# Altium project Direct FM modulator test.PrjPcb
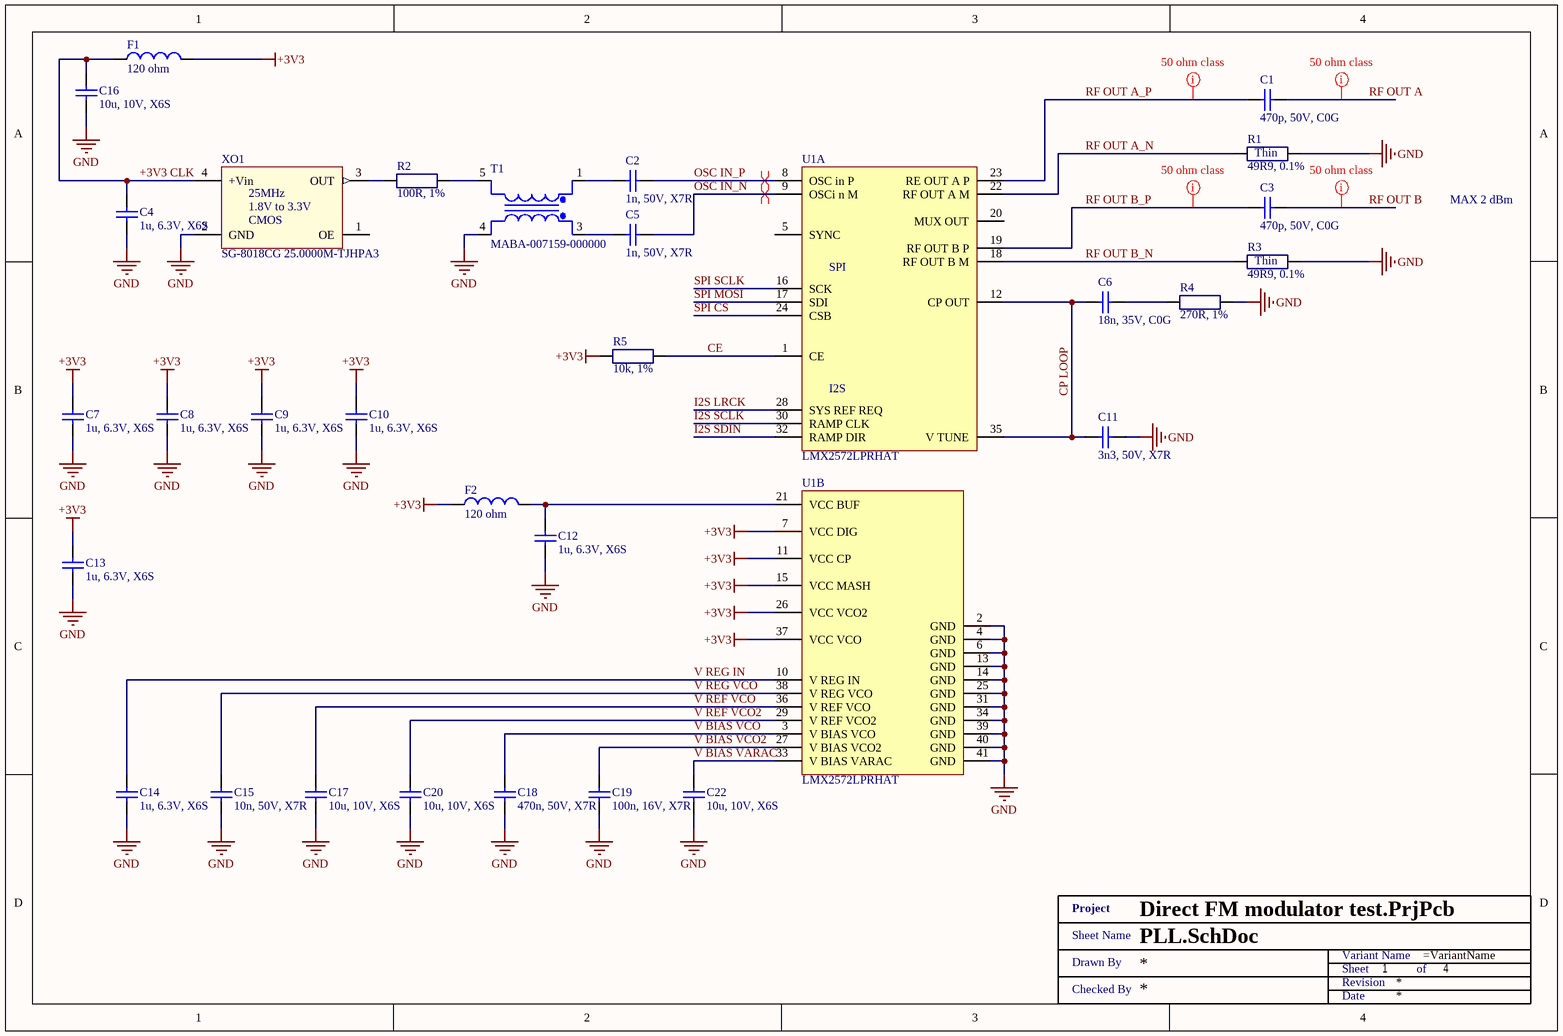
[diagram p0: PLL.SchDoc]
4 sheets, 49 parts. Net scope: global (net labels, ports and power ports of the same name join across sheets).
Board file: Direct FM modulator test.PcbDoc
Sheets:
  PLL.SchDoc
  Filter and output.SchDoc
  Connectors.SchDoc
  Poznamky.SchDoc

## Sheet PLL.SchDoc
size A4; DocumentNumber: 1; SheetNumber: 1; SheetTotal: 4

### Parts
(Parts that share a designator on the sheet are numbered #1, #2 ... from top to bottom, then left to right.)
C1  470p, 50V, C0G  [SMD0402]
C2  1n, 50V, X7R  [SMD0402]
C3  470p, 50V, C0G  [SMD0402]
C4  1u, 6.3V, X6S  [SMD0402]
C5  1n, 50V, X7R  [SMD0402]
C6  18n, 35V, C0G  [SMD0603]
C7  1u, 6.3V, X6S  [SMD0402]
C8  1u, 6.3V, X6S  [SMD0402]
C9  1u, 6.3V, X6S  [SMD0402]
C10  1u, 6.3V, X6S  [SMD0402]
C11  3n3, 50V, X7R  [SMD0603]
C12  1u, 6.3V, X6S  [SMD0402]
C13  1u, 6.3V, X6S  [SMD0402]
C14  1u, 6.3V, X6S  [SMD0402]
C15  10n, 50V, X7R  [SMD0402]
C16  10u, 10V, X6S  [SMD0603]
C17  10u, 10V, X6S  [SMD0603]
C18  470n, 50V, X7R  [SMD0603]
C19  100n, 16V, X7R  [SMD0402]
C20  10u, 10V, X6S  [SMD0603]
C22  10u, 10V, X6S  [SMD0603]
F1  120 ohm  [SMD0805 - R]
F2  120 ohm  [SMD0805 - R]
R1  49R9, 0.1%  [SMD0402 - R]
R2  100R, 1%  [SMD0402 - R]
R3  49R9, 0.1%  [SMD0402 - R]
R4  270R, 1%  [SMD0603 - R]
R5  10k, 1%  [SMD0603 - R]
T1  MABA-007159-000000  [MABA-007159-000000]
U1  LMX2572LPRHAT  [VQFN50P600X600X100_HS-41N]  (parts A,B of 2)
XO1  SG-8018CG 25.0000M-TJHPA3  [XO 2.5x2.0mm]
XX?#1  Title 1  (value not drawn)  (graphical)

### Nets
+3V3: C7.2 C8.2 C9.2 C10.2 C13.2 F1.2 F2.1 R5.2 U1.7(VCC_DIG) U1.11(VCC_CP) U1.15(VCC_MASH) U1.26(VCC_VCO2) U1.37(VCC_VCO)
GND: C4.1 C7.1 C8.1 C9.1 C10.1 C11.1 C12.1 C13.1 C14.1 C15.1 C16.1 C17.1 C18.1 C19.1 C20.1 C22.1 R1.2 R3.2 R4.1 T1.4(Primary) U1.2(GND) U1.4(GND) U1.6(GND) U1.13(GND) U1.14(GND) U1.25(GND) U1.31(GND) U1.34(GND) U1.39(GND) U1.40(GND) U1.41(GND) XO1.2(GND)
+3V3 CLK: C4.2 C16.2 F1.1 XO1.4(+Vin)
CE: R5.1 U1.1(CE)
CP LOOP: C6.1 C11.2 U1.12(CP_OUT) U1.35(V_TUNE)
I2S LRCK: U1.28(SYS_REF_REQ)
I2S SCLK: U1.30(RAMP_CLK)
I2S SDIN: U1.32(RAMP_DIR)
OSC IN_N: C5.2 U1.9(OSCi_n_M)
OSC IN_P: C2.2 U1.8(OSC_in_P)
RF OUT A: C1.2
RF OUT A_N: R1.1 U1.22(RF_OUT_A_M)
RF OUT A_P: C1.1 U1.23(RE_OUT_A_P)
RF OUT B: C3.2
RF OUT B_N: R3.1 U1.18(RF_OUT_B_M)
RF OUT B_P: C3.1 U1.19(RF_OUT_B_P)
SPI CS: U1.24(CSB)
SPI MOSI: U1.17(SDI)
SPI SCLK: U1.16(SCK)
V BIAS VARAC: C22.2 U1.33(V_BIAS_VARAC)
V BIAS VCO: C18.2 U1.3(V_BIAS_VCO)
V BIAS VCO2: C19.2 U1.27(V_BIAS_VCO2)
V REF VCO: C17.2 U1.36(V_REF_VCO)
V REF VCO2: C20.2 U1.29(V_REF_VCO2)
V REG IN: C14.2 U1.10(V_REG_IN)
V REG VCO: C15.2 U1.38(V_REG_VCO)
NetC2_1: C2.1 T1.1(Secondary_Dot)
NetC5_1: C5.1 T1.3(Secondary)
NetC6_2: C6.2 R4.2
NetC12_2: C12.2 F2.2 U1.21(VCC_BUF)
NetR2_1: R2.1 XO1.3(OUT)
NetR2_2: R2.2 T1.5(Primary_Dot)

Not connected (* = marked no-connect by the designer): U1 5(SYNC) 20(MUX_OUT); XO1 1(OE)

### Layout directives
differential pair: OSC IN_N, OSC IN_P
net class 50 ohm: RF OUT A, RF OUT A_P, RF OUT B, RF OUT B_P

### Notes on the sheet
- MAX 2 dBm
- (in symbol AT0402BRD0749R9L) Thin
- (in symbol LMX2572LPRHAT, part A) SPI; I2S
- (in symbol SG-8018CG 25.0000M-TJHPA3) 1.8V to 3.3V; CMOS
- (in symbol Title 1) Project; Sheet Name; Variant Name; Drawn By; Sheet; of; Revision; Checked By; Date

### Library data of the parts
C1 C3 = GCM1555C1H471FA16D: Cap Ceramic 470pF 50V C0G 1% Pad SMD 0402 125°C Automotive T/R; Manufacturer: Murata; Supplier 1: Mouser; Supplier Part Number 1: 81-GCM1555C1H471FA6D; Manufacturer Part Number: GCM1555C1H471FA16D; RoHS: Yes; Category: Ceramic Capacitors; Stock 1: 34290; Pricing 1: 1=0.12000, 10=0.06100, 50=0.06100, 100=0.04400, 1000=0.02700, 10000=0.01900 (USD); Supplier 2: Farnell; Supplier Part Number 2: 3582659; Capacitance: 470p
C2 C5 = MC0402B102K500CT: MULTICOMP - MC0402B102K500CT - CAP, MLCC, X7R, 1NF, 50V, 0402; Ceramic Capacitor Case: 0402 [1005 Metric]; Voltage Rating: 50; Capacitance Tolerance: ± 10%; Dielectric Characteristic: X7; Product Range: MC Series; SVHC: No SVHC (07-Jul-2017); Capacitor Terminals: SMD; External Depth: 1; External Length / Height: 0.5; No. of Pins: 2; Supplier 1: Farnell; Supplier Part Number 1: 1758991; Manufacturer: MULTICOMP; Manufacturer Part Number: MC0402B102K500CT; RoHS: YES; Stock 1: 83283; Pricing 1: 10=0,0036, 100=0,0032, 500=0,0029, 2500=0,0021, 5000=0,0018 (GBP); Capacitance: 1n; Packaging: Cut Tape; Operating Temperature Min: -55; Operating Temperature Max: 125; Automotive Qualification Standard: -; MSL: -; Capacitance Tolerance ±: ± 10%; External Width: 0.5; Operating Temperature Range: -55°C to +125°C<!--FANDB--><div class="features-and-benefits-container"><div class="features-and-benefits-desc-container"><span class="features-and-benefits-container-desc">SMD Multilayer Ceramic Capacitor, 0402 [1005 Metric], 1000 pF, 50 V, ± 10%, X7R, MC Series</span></div><div class="features-and-benefits-description"><span class="features-benefits-value">The Multicomp MC series is general purpose MLCC capacitors with X7R dielectric material which provides high electrical precision, stability and reliability. This MLCC capacitor consists of a conducting material and electrodes with high density and high efficiency ceramic condensers.</span></div><div class="features-and-benefits-list"><ul class="features-and-benefits-list-list"><li class="features-and-benefits-list-item">Small size with higher capacitance values</li><li class="features-and-benefits-list-item">0201, 0402, 0603, 0805, 1206, 1210, 1812 case sizes available</li><li class="features-and-benefits-list-item">Capacitance value ranging from 100pF to 47?F</li><li class="features-and-benefits-list-item">Capacitor with lead free termination (pure Tin)</li><li class="features-and-benefits-list-item">High electrical precision, stability and reliability</li><li class="features-and-benefits-list-item">Rated voltage of 6.3V, 10V, 16V, 25V, 50V, 100V</li><li class="features-and-benefits-list-item">Operating temperature of -55°C to +125°C</li><li class="features-and-benefits-list-item">Available in ±5%, ±10% and ±20; ComponentLink1URL: http://www.farnell.com/datasheets/1901289.pdf; ComponentLink1Description: http://www.farnell.com/datasheets/1901289.pdf
C4 C7-C10 C12-C14 = GRT155C80J105KE01D: MURATA - GRT155C80J105KE01D - CAP, MLCC, AECQ200, X6S, 1UF, 6.3V, 0402; Ceramic Capacitor Case: 0402 [1005 Metric]; Voltage Rating: 6.3; Capacitance Tolerance: ± 10%; Dielectric Characteristic: X6; Product Range: GRT Series; Automotive Qualification Standard: AEC-Q200; SVHC: No SVHC (20-Jun-2016)<!--FANDB--><div class="features-and-benefits-container"><div class="features-and-benefits-description"><span class="features-benefits-value">The GRT155C80J105KE01D from Murata is a GRT series AEC-Q200 automotive-grade monolithic ceramic capacitor. This capacitor meets the AEC-Q200 reliability test standard requirements established by the Automotive Electronics Council. GRT series MLCC capacitors are classified into temperature compensating and high dielectric constant types depending on the change in electrostatic capacitance due to change in temperature. The temperature compensating capacitors feature a small rate of change in electrostatic capacitance as the temperature changes and are used for applications such as filters and high frequency circuit matching. The high dielectric constant capacitors use materials with a high dielectric constant and feature a large electrostatic capacitance. It is designed for use in car multimedia, car interior, car comfort application and general electronic equipment. It is not appropriate for use in applications critical to passenger safety and car driving function (ABS, AIRBAG etc).</span></div><div class="features-and-benefits-list"><ul class="features-and-benefits-list-list"><li class="features-and-benefits-list-item">AEC-Q200 automotive grade qualified</li><li class="features-and-benefits-list-item">Tin plated external electrodes, excellent solderability</li><li class="features-and-benefits-list-item">Capacitance value is 1µF</li><li class="features-and-benefits-list-item">Capacitance tolerance is ±10%</li><li class="features-and-benefits-list-item">Capacitor case size is 0402 [1005 Metric]</li><li class="features-and-benefits-list-item">X6S dielectric material</li><li class="features-and-benefits-list-item">Operating temperature range from -55°C to 105°C</li><li class="features-and-benefits-list-item">Voltage rating is 6.3; Supplier 1: Farnell; Supplier Part Number 1: 2672103; Manufacturer: MURATA; Manufacturer Part Number: GRT155C80J105KE01D; RoHS: YES; Stock 1: 19999; Pricing 1: 10=0,0194, 100=0,0149, 500=0,0108, 2500=0,0079, 5000=0,0069, 10000=0,0062, 50000=0,0048, 100000=0,0047 (GBP); Capacitance: 1u; Packaging: Cut Tape; Operating Temperature Min: -55; Operating Temperature Max: 105; MSL: MSL 1 - Unlimited; ComponentLink1URL: http://www.farnell.com/datasheets/2165909.pdf; ComponentLink1Description: http://www.farnell.com/datasheets/2165909.pdf
C6 = C1608C0G1V183J080AC: Cap Ceramic 0.018uF 35V C0G 5% Pad SMD 0603 125C T/R; Manufacturer: TDK; Supplier 1: Mouser; Supplier Part Number 1: 810-C1608C0G1V183JAC; Manufacturer Part Number: C1608C0G1V183J080AC; RoHS: Yes; Category: Ceramic Capacitors; Stock 1: 3185; Pricing 1: 1=0.37000, 10=0.16800, 50=0.16800, 100=0.14300, 1000=0.08800, 10000=0.06600 (USD); Mount: Surface Mount; Case/Package: 0603; Case Code (Metric): 1608; Case Code (Imperial): 0603; Dielectric Material: Ceramic; Min Operating Temperature: -55°C; Max Operating Temperature: 125°C; Packaging: Tape and Reel; Capacitance: 18n; Voltage Rating: 35V; Tolerance: 5%; Voltage Rating (DC): 35V; Length: 0.063inch; Width: 0.031inch; Thickness: 0.035inch; Lead Free: Lead Free; RoHS Compliant: Yes; ComponentLink1URL: https://product.tdk.com/info/en/catalog/spec/mlccspec_commercial_general_midvoltage_en.pdf?src-supplier=Digi-Key; ComponentLink1Description: https://product.tdk.com/info/en/catalog/spec/mlccspec_commercial_general_midvoltage_en.pdf?src-supplier=Digi-Key; Supplier 2: Farnell; Supplier Part Number 2: 3416084; Supplier 3: Digi-Key; Supplier Part Number 3: 445-174558-1-ND; Supplier 4: Newark; Supplier Part Number 4: 71AH3230
C11 = 0603B332K500CT: WALSIN - 0603B332K500CT - CAPACITOR, MLCC, X7R, 3300PF, 50V, 0603; Ceramic Capacitor Case: 0603 [1608 Metric]; Voltage Rating: 50; Capacitance Tolerance: ± 10%; Dielectric Characteristic: X7; Supplier 1: Farnell; Supplier Part Number 1: 2496853; Manufacturer: WALSIN; Manufacturer Part Number: 0603B332K500CT; RoHS: YES; Stock 1: 10797; Pricing 1: 10=0,0068, 100=0,0053, 500=0,0038, 1000=0,0031, 2000=0,0027 (GBP); Capacitance: 3n3; Product Range: -; Packaging: Cut Tape; Operating Temperature Min: -55; Operating Temperature Max: 125; Automotive Qualification Standard: -; MSL: MSL 1 - Unlimited<!--FANDB--><div class="features-and-benefits-container"><div class="features-and-benefits-desc-container"><span class="features-and-benefits-container-desc">SMD Multilayer Ceramic Capacitor, 0603 [1608 Metric], 3300 pF, 50 V, ± 10%, X7R</span></div><div class="features-and-benefits-description"><span class="features-benefits-value">The general purpose series capacitors from Walsin are X7R dielectric multilayer ceramic chip capacitors (MLCC) that provides high electrical precision, stability and reliability. These MLCC capacitors consist of a conducting material and electrodes. The high density and high efficiency ceramic condensers are used to manufacture chip type miniaturized MLCC capacitors.</span></div><div class="features-and-benefits-list"><ul class="features-and-benefits-list-list"><li class="features-and-benefits-list-item">Capacitance values ranges from 100pF to 47?F</li><li class="features-and-benefits-list-item">EIA 0201, 0402, 0603, 0805, 1206, 1210, 1812 case sizes available</li><li class="features-and-benefits-list-item">Available voltage ratings are 6.3V, 10V, 16V, 25V, 35V, 50V, 100V</li><li class="features-and-benefits-list-item">Operating temperature range from -55°C to 125°C</li><li class="features-and-benefits-list-item">Available in ±5%, ±10%, ±20; ComponentLink1URL: http://www.farnell.com/datasheets/2340522.pdf; ComponentLink1Description: http://www.farnell.com/datasheets/2340522.pdf; Supplier 2: Digi-Key; Supplier Part Number 2: BC1249TR-ND
C15 = MC0402B103K500CT: MULTICOMP - MC0402B103K500CT - CAP, MLCC, X7R, 0.01UF, 50V, 0402; Ceramic Capacitor Case: 0402 [1005 Metric]; Voltage Rating: 50; Capacitance Tolerance: ± 10%; Dielectric Characteristic: X7; Product Range: MC Series; SVHC: No SVHC (12-Jan-2017)<!--FANDB--><div class="features-and-benefits-container"><div class="features-and-benefits-desc-container"><span class="features-and-benefits-container-desc">SMD Multilayer Ceramic Capacitor, 0402 [1005 Metric], 0.01 µF, 50 V, ± 10%, X7R, MC Series</span></div><div class="features-and-benefits-description"><span class="features-benefits-value">The Multicomp MC series are general purpose MLCC (Multilayer Ceramic Capacitor) capacitors with X7R dielectric material which provides high electrical precision, stability and reliability. These MLCC capacitors consists of a conducting material and electrodes with high density and high efficiency ceramic condensers.</span></div><div class="features-and-benefits-list"><ul class="features-and-benefits-list-list"><li class="features-and-benefits-list-item">Small size with higher capacitance values</li><li class="features-and-benefits-list-item">0201, 0402, 0603, 0805, 1206, 1210, 1812 case sizes available</li><li class="features-and-benefits-list-item">Capacitance value ranging from 100pF to 47?F</li><li class="features-and-benefits-list-item">Cu/Ni/Sn termination</li><li class="features-and-benefits-list-item">High electrical precision, stability and reliability</li><li class="features-and-benefits-list-item">Available in 6.3V, 10V, 16V, 25V, 50V and 100V rated voltages</li><li class="features-and-benefits-list-item">Operating temperature of -55°C to +125°C</li><li class="features-and-benefits-list-item">Available in ±5%, ±10% and ±20% tolerances</li><li class="features-and-benefits-list-item">Capacitance characteristic of ±15; Supplier 1: Farnell; Supplier Part Number 1: 2627340; Manufacturer: MULTICOMP; Manufacturer Part Number: MC0402B103K500CT; RoHS: YES; Stock 1: 29387; Pricing 1: 10=0,0043, 100=0,0039, 500=0,0035, 2500=0,0021, 5000=0,0017 (GBP); Capacitance: 10n; Packaging: Cut Tape; Operating Temperature Min: -55; Operating Temperature Max: 125; Automotive Qualification Standard: -; MSL: MSL 1 - Unlimited; ComponentLink1URL: http://www.farnell.com/datasheets/2117933.pdf; ComponentLink1Description: http://www.farnell.com/datasheets/2117933.pdf
C16 C17 C20 C22 = GRT188C81A106ME13D: Cap Ceramic 10uF 10V X6S 20% Pad SMD 0603 105C Automotive T/R; Manufacturer: Murata; Supplier 1: Mouser; Supplier Part Number 1: 81-GRT188C81A106ME3D; Manufacturer Part Number: GRT188C81A106ME13D; RoHS: No; Category: Ceramic Capacitors; Stock 1: 1862; Pricing 1: 1=0.41000, 10=0.20100, 50=0.20100, 100=0.17200, 1000=0.10900, 10000=0.09700 (USD); Mount: Surface Mount; Case/Package: 0603; Case Code (Metric): 1608; Case Code (Imperial): 0603; Min Operating Temperature: -55°C; Max Operating Temperature: 105°C; Packaging: Tape and Reel; Capacitance: 10uF; Voltage Rating: 10V; Tolerance: 20%; Length: 0.063inch; Width: 0.031inch; Thickness: 0.035inch; Ratings: AEC-Q200; ComponentLink1URL: http://search.murata.co.jp/Ceramy/image/img/A01X/G101/ENG/GRT188C81A106ME13-01.pdf?src-supplier=Digi-Key; ComponentLink1Description: http://search.murata.co.jp/Ceramy/image/img/A01X/G101/ENG/GRT188C81A106ME13-01.pdf?src-supplier=Digi-Key; Supplier 2: Farnell; Supplier Part Number 2: 3582904; Supplier 3: Digi-Key; Supplier Part Number 3: 490-12283-6-ND
C18 = C1608X7R1H474K080AC: TDK - C1608X7R1H474K080AC - SMD Multilayer Ceramic Capacitor, 0.47 µF, 50 V, 0603 [1608 Metric], ± 10%, X7R, C Series TDK; Supplier 1: Mouser; Supplier Part Number 1: 810-C1608X7R1H474K; Manufacturer: TDK; Manufacturer Part Number: C1608X7R1H474K080AC; RoHS: Yes; Category: Ceramic Capacitors; Stock 1: 163800; Pricing 1: 1=0,28000, 10=0,14200, 100=0,09100, 500=0,07500, 1000=0,06100, 4000=0,04900 (USD); Mount: Surface Mount; Case/Package: 0603; Weight: 7.1E-05oz; Dielectric Material: Ceramic; Case Code (Metric): 1608; Case Code (Imperial): 0603; Min Operating Temperature: -55°C; Max Operating Temperature: 125°C; Dielectric: X7R; Capacitance: 470n; Tolerance: 10%; Voltage Rating (DC): 50V; Termination: SMD/SMT; Voltage Rating: 50V; Packaging: Tape and Reel; Composition: Ceramic; Package Quantity: 4000; Voltage: 50V; Length: 1.6mm; Height: 0.8mm; Depth: 0.8mm; Width: 0.031inch; Thickness: 0.037inch; Radiation Hardening: No; Lead Free: Lead Free; REACH SVHC: No SVHC; ComponentLink1URL: https://datasheet.ciiva.com/28693/1735394-28693461.pdf?src-supplier=Element14; ComponentLink1Description: https://datasheet.ciiva.com/28693/1735394-28693461.pdf?src-supplier=Element14; ComponentLink2URL: https://datasheet.ciiva.com/6290/tdkmlcccaprange-6290870.pdf?src-supplier=Digi-Key; ComponentLink2Description: https://datasheet.ciiva.com/6290/tdkmlcccaprange-6290870.pdf?src-supplier=Digi-Key; ComponentLink3URL: https://datasheet.ciiva.com/22718/1904212-22718022.pdf?src-supplier=Element14; ComponentLink3Description: https://datasheet.ciiva.com/22718/1904212-22718022.pdf?src-supplier=Element14; ComponentLink4URL: https://datasheet.ciiva.com/28451/1904212-28451367.pdf?src-supplier=Element14; ComponentLink4Description: https://datasheet.ciiva.com/28451/1904212-28451367.pdf?src-supplier=Element14; ComponentLink5URL: https://datasheet.ciiva.com/6290/tdkmlcccaprange-6290878.pdf?src-supplier=Digi-Key; ComponentLink5Description: https://datasheet.ciiva.com/6290/tdkmlcccaprange-6290878.pdf?src-supplier=Digi-Key; ComponentLink6URL: https://datasheet.ciiva.com/6290/tdkmlcccaprange-6290874.pdf?src-supplier=Digi-Key; ComponentLink6Description: https://datasheet.ciiva.com/6290/tdkmlcccaprange-6290874.pdf?src-supplier=Digi-Key; ComponentLink7URL: https://datasheet.ciiva.com/17487/e412-c-17487386.pdf?src-supplier=Avnet+Europe; ComponentLink7Description: https://datasheet.ciiva.com/17487/e412-c-17487386.pdf?src-supplier=Avnet+Europe; ComponentLink8URL: https://datasheet.ciiva.com/16427/e412-c-16427759.pdf?src-supplier=Future+Electronics; ComponentLink8Description: https://datasheet.ciiva.com/16427/e412-c-16427759.pdf?src-supplier=Future+Electronics; Supplier 2: Farnell; Supplier Part Number 2: 2522012; Supplier 3: Digi-Key; Supplier Part Number 3: 445-5952-1-ND
C19 = MC0402B104K160CT: MULTICOMP - MC0402B104K160CT - CAP, MLCC, X7R, 100NF, 16V, 0402; Ceramic Capacitor Case: 0402 [1005 Metric]; Voltage Rating: 16; Capacitance Tolerance: ± 10%; Dielectric Characteristic: X7; Product Range: MC Series; SVHC: No SVHC (07-Jul-2017); Capacitor Terminals: SMD; External Depth: 1; External Length / Height: 0.5; No. of Pins: 2; Supplier 1: Farnell; Supplier Part Number 1: 1758896; Manufacturer: MULTICOMP; Manufacturer Part Number: MC0402B104K160CT; RoHS: YES; Stock 1: 315490; Pricing 1: 10=0,0043, 100=0,0039, 500=0,0035, 2500=0,0021, 5000=0,0017 (GBP); Capacitance: 100n; Packaging: Cut Tape; Operating Temperature Min: -55; Operating Temperature Max: 125; Automotive Qualification Standard: -; MSL: -; Capacitance Tolerance ±: ± 10%; External Width: 0.5; Operating Temperature Range: -55°C to +125°C<!--FANDB--><div class="features-and-benefits-container"><div class="features-and-benefits-desc-container"><span class="features-and-benefits-container-desc">SMD Multilayer Ceramic Capacitor, 0402 [1005 Metric], 0.1 µF, 16 V, ± 10%, X7R, MC Series</span></div><div class="features-and-benefits-description"><span class="features-benefits-value">The Multicomp MC series is general purpose MLCC capacitors with X7R dielectric material which provides high electrical precision, stability and reliability. This MLCC capacitor consists of a conducting material and electrodes with high density and high efficiency ceramic condensers.</span></div><div class="features-and-benefits-list"><ul class="features-and-benefits-list-list"><li class="features-and-benefits-list-item">Small size with higher capacitance values</li><li class="features-and-benefits-list-item">0201, 0402, 0603, 0805, 1206, 1210, 1812 case sizes available</li><li class="features-and-benefits-list-item">Capacitance value ranging from 100pF to 47?F</li><li class="features-and-benefits-list-item">Capacitor with lead free termination (pure Tin)</li><li class="features-and-benefits-list-item">High electrical precision, stability and reliability</li><li class="features-and-benefits-list-item">Rated voltage of 6.3V, 10V, 16V, 25V, 50V, 100V</li><li class="features-and-benefits-list-item">Operating temperature of -55°C to +125°C</li><li class="features-and-benefits-list-item">Available in ±5%, ±10% and ±20; ComponentLink1URL: http://www.farnell.com/datasheets/1901289.pdf; ComponentLink1Description: http://www.farnell.com/datasheets/1901289.pdf
F1 F2 = 742792023: WURTH ELEKTRONIK - 742792023 - FERRITE BEAD, 0.03OHM, 3A, 0805; Impedance @ 100MHz: 120; Ferrite Case Style: 0805 [2012 Metric]; DC Current Rating: 3; DC Resistance Max: 0.03; Impedance Tolerance: ± 25%; Ferrite Mounting: SMD; Resistance: 0.03ohm<!--FANDB--><div class="features-and-benefits-container"><div class="features-and-benefits-description"><span class="features-benefits-value">The 742792023 is a SMD EMI Suppression Ferrite Bead with 0805 case and reliable Ni-Sn electrodes. It can be put directly on the printed circuit board. It offers excellent anti-EMI properties and low DC resistance. Placed very close next to the interference source even with smallest size 0402, maximal impedance at 1000; Manufacturer: WURTH ELEKTRONIK; Manufacturer Part Number: 742792023; RoHS: YES; Stock 1: 4283; Pricing 1: 1=0,123, 50=0,112, 100=0,103, 500=0,0937, 1000=0,0877, 2000=0,0846 (GBP); Product Range: -; Automotive Qualification Standard: -; Packaging: Cut Tape; ComponentLink1URL: http://www.farnell.com/datasheets/1695980.pdf; ComponentLink1Description: http://www.farnell.com/datasheets/1695980.pdf; ComponentLink2URL: http://www.farnell.com/cad/1670054.zip; ComponentLink2Description: http://www.farnell.com/cad/1670054.zip; Supplier 1: Mouser; Supplier Part Number 1: 710-742792023; Supplier 2: Farnell; Supplier Part Number 2: 1635732; Supplier 3: Digi-Key; Supplier Part Number 3: 732-1613-1-ND
R1 R3 = AT0402BRD0749R9L: Thin Film Resistors - SMD 49.9 Ohms 0.1% Tol. AEC-Q200; Manufacturer: Yageo; Power Rating: 62.5 mW (1/16 W); Temperature Coefficient: 25 PPM / C; Voltage Rating: 50 V; CNHTS: 8533211000; MXHTS: 85332101; TARIC: 8533210000; Supplier 1: Mouser; Supplier Part Number 1: 603-AT0402BRD0749R9L; Manufacturer Part Number: AT0402BRD0749R9L; RoHS: RoHS Compliant; Category: Thin Film Resistors - SMD; Stock 1: 9662; Pricing 1: 1=0.594, 10=0.346, 100=0.139, 1000=0.106, 2500=0.081, 10000=0.079, 20000=0.077 (EUR); Diameter: -; Features: -; Height: 0.3 mm; Length: 1 mm; Operating Temperature Range: - 55 C to + 125 C; Package / Case: 0402 (1005 metric); Packaging: Cut Tape; Product: Thin Film Resistors SMD; Resistance: 49.9 Ohms; Series: AT; Termination Style: SMD/SMT; Tolerance: 0.1 %; Type: High Precision High Stability Chip Resistors; Width: 0.5 mm; Brand: Yageo; Mounting Style: PCB Mount; Case Code - in: 0402; Case Code - mm: 1005; HTS Code: 8533210030; Maximum Operating Temperature: + 125 C; Minimum Operating Temperature: - 55 C; Product Type: Thin Film Resistors; Qualification: AEC-Q200; Standard Pack Qty: 10000; Subcategory: Resistors; RoHS - Mouser: Y; Minimum Order Quantity: 1; Reeling: True; ComponentLink1URL: http://www.mouser.com/datasheet/2/447/PYu-AT_51_RoHS_L_5-1222714.pdf; ComponentLink1Description: http://www.mouser.com/datasheet/2/447/PYu-AT_51_RoHS_L_5-1222714.pdf
R2 = RC0402FR-07100RL: YAGEO - RC0402FR-07100RL - RES, 100R, 1%, 0.0625W, 0402, THICK FILM; Resistor Case Style: 0402 [1005 Metric]; Resistance: 100; Product Range: RC Series; Voltage Rating: 50; Power Rating: 62.5; Temperature Coefficient: ± 100; SVHC: No SVHC (27-Jun-2018); Reel Quantity: 10000<!--FANDB--><div class="features-and-benefits-container"><div class="features-and-benefits-desc-container"><span class="features-and-benefits-container-desc">SMD Chip Resistor, 0402 [1005 Metric], 100 ohm, RC Series, 50 V, Thick Film, 62.5 mW</span></div><div class="features-and-benefits-description"><span class="features-benefits-value">The Yageo RC_L series resistors are general purpose thick film chip resistors with lead free terminations made by thick film process. The resistance range includes E24 and E96 decade values from 1ohm to 100Mohm. These resistors are constructed on top of a high grade ceramic body.</span></div><div class="features-and-benefits-list"><ul class="features-and-benefits-list-list"><li class="features-and-benefits-list-item">EIA 0075, 0100, 0201, 0402, 0603, 0805, 1206, 1210, 1218, 2010, 2512 case sizes available</li><li class="features-and-benefits-list-item">Small chip sizes save PCB space</li><li class="features-and-benefits-list-item">Rated voltage range of 10V to 200V</li><li class="features-and-benefits-list-item">Maximum power rating of 2W</li><li class="features-and-benefits-list-item">Available in ±0.1%, ±0.5%, ±1% and ±5% tolerance</li><li class="features-and-benefits-list-item">High component and equipment reliability</li><li class="features-and-benefits-list-item">Forbidden materials are not used in products/production</li><li class="features-and-benefits-list-item">-55°C to 155°C temperature range for RC0402 to RC2512 and -55°C to 125°C for RC0075 to RC0201; Supplier 1: Farnell; Supplier Part Number 1: 9239111; Manufacturer: YAGEO; Manufacturer Part Number: RC0402FR-07100RL; RoHS: YES; Stock 1: 260492; Pricing 1: 10=0.385, 100=0.38, 500=0.285, 2500=0.144, 5000=0.121 (EUR); Resistor Element Material: Thick Film; Resistance Tolerance: ± 1%; Automotive Qualification Standard: -; MSL: MSL 1 - Unlimited; Operating Temperature Max: 155; Operating Temperature Min: -55; ComponentLink1URL: http://www.farnell.com/datasheets/2167052.pdf; ComponentLink1Description: http://www.farnell.com/datasheets/2167052.pdf; Supplier 2: Mouser; Supplier Part Number 2: 603-RC0402FR-07100RL
R4 = WR06X2700FTL: WALSIN - WR06X2700FTL - RES, THICK FILM, 270R, 1%, 75V, 0603; Voltage Rating: 75; Resistor Case Style: 0603 [1608 Metric]; Power Rating: 100; Product Range: WR06 Series; Temperature Coefficient: ± 100; Supplier 1: Farnell; Supplier Part Number 1: 2502438; Manufacturer: WALSIN; Manufacturer Part Number: WR06X2700FTL; RoHS: YES; Stock 1: 6379; Pricing 1: 10=0.0132, 100=0.0044, 500=0.0027, 1000=0.0019, 2500=0.0014 (GBP); Resistance: 270R; Resistance Tolerance: ± 1%; Packaging: Cut Tape; Resistor Element Material: Thick Film; Automotive Qualification Standard: -; MSL: MSL 2 - 1 year<!--FANDB--><div class="features-and-benefits-container"><div class="features-and-benefits-desc-container"><span class="features-and-benefits-container-desc">SMD Chip Resistor, 270 ohm, 75 V, 0603 [1608 Metric], 100 mW, ± 1%, WR06 Series</span></div><div class="features-and-benefits-description"><span class="features-benefits-value">The WR06 series resistors from Walsin are general purpose thick film chip resistors. These resistors are constructed in a high grade ceramic body (aluminium oxide).</span></div><div class="features-and-benefits-list"><ul class="features-and-benefits-list-list"><li class="features-and-benefits-list-item">Resistance range includes E24 and E96 decade values from 1ohm to 10Mohm</li><li class="features-and-benefits-list-item">EIA 0603 case size</li><li class="features-and-benefits-list-item">Available in ?±100ppm/°C and -200ppm/°C to +400ppm/°C TCR values</li><li class="features-and-benefits-list-item">Available in ±1% and ±5% tolerance</li><li class="features-and-benefits-list-item">High reliability and stability</li><li class="features-and-benefits-list-item">Higher component and equipment reliability</li><li class="features-and-benefits-list-item">Lower assembly costs</li><li class="features-and-benefits-list-item">Reduced size of final equipment</li><li class="features-and-benefits-list-item">Continuous working voltage is 75V and rated power is 100; ComponentLink1URL: http://www.farnell.com/datasheets/1960319.pdf; ComponentLink1Description: http://www.farnell.com/datasheets/1960319.pdf
R5 = RC0603FR-0710KL: YAGEO (PHYCOMP) - RC0603FR-0710KL - RES, THICK FILM, 10K, 1%, 0.1W, 0603; Voltage Rating: 50; Resistor Case Style: 0603 [1608 Metric]; Power Rating: 100; Product Range: RC Series; Temperature Coefficient: ± 100; SVHC: No SVHC (20-Jun-2016); Manufacturer: YAGEO (PHYCOMP); Manufacturer Part Number: RC0603FR-0710KL; RoHS: YES; Stock 1: 9995; Pricing 1: 5000=0.0025, 25000=0.0014, 50000=0.0013 (GBP); Resistance: 10k; Resistance Tolerance: ± 1%; Packaging: Tape & Reel; Resistor Element Material: Thick Film; Automotive Qualification Standard: -; MSL: MSL 1 - Unlimited<!--FANDB--><div class="features-and-benefits-container"><div class="features-and-benefits-desc-container"><span class="features-and-benefits-container-desc">SMD Chip Resistor, Thick Film, 10 kohm, 50 V, 0603 [1608 Metric], 100 mW, ± 1; ComponentLink1URL: http://past.yageo.com/pdf/PYu-R_Packing_6.pdf; ComponentLink1Description: http://past.yageo.com/pdf/PYu-R_Packing_6.pdf; ComponentLink2URL: http://www.farnell.com/datasheets/2167052.pdf; ComponentLink2Description: http://www.farnell.com/datasheets/2167052.pdf; Supplier 1: Mouser; Supplier Part Number 1: 603-RC0603FR-0710KL; Supplier 2: Farnell; Supplier Part Number 2: 2421850; Supplier 3: Digi-Key; Supplier Part Number 3: 311-10.0KHRCT-ND
T1 = MABA-007159-000000: Transformator 4.5-3000MHz IL 2dB Impedance Ratio 1:1; Manufacturer: M/A-Com Technology Solutions; Frequency Range: 4.5MHz ~ 3GHz; Insertion Loss (Max): 3.5dB; Supplier Part Number 1: 937-MABA007159000000; Name: MABA-007159-000000; Datasheet: http://www.mouser.com/ds/2/249/MABA-007159-000000-318068.pdf; Supplier 1: Mouser; Supplier 2: Digi-Key; Supplier Part Number 2: 1465-1302-1-ND; Manufacturer Part Number: MABA-007159-000000; RoHS: RoHS Compliant; Category: RF/IF and RFID; Stock 2: 26395; Pricing 2: 1=1.72, 10=1.379, 25=1.1208, 50=1.092, 100=1.0633, 250=1.03456, 500=1.02592, 1000=0.90811 (USD); Packaging: Cut Tape (CT); Impedance - Unbalanced/Balanced: 1:1; Phase Difference: -; Return Loss (Min): -; Package / Case: 6-SMD (5 Leads), Flat Lead; Mounting Type: Surface Mount; ComponentLink1URL: http://cdn.macom.com/datasheets/MABA-007159-000000.pdf; ComponentLink1Description: http://cdn.macom.com/datasheets/MABA-007159-000000.pdf
U1 = LMX2572LPRHAT: 2-GHz Low Power Wideband RF Synthesizer With FSK Modulation 40-VQFN -40 to 85; Manufacturer: Texas Instruments; PLL: Yes; Input: Clock; Number of Circuits: 1; Max Frequency: 2GHz; Supplier 1: Mouser; Supplier Part Number 1: 595-LMX2572LPRHAT; Manufacturer Part Number: LMX2572LPRHAT; RoHS: Yes; Category: Clock Generators, PLLs, Frequency Synthesizers; Stock 1: 77; Pricing 1: 1=14.10000, 10=12.96000, 50=12.43000, 100=10.95000, 1000=10.40000, 10000=10.40000 (USD); Mount: Surface Mount; Case/Package: VQFN; Min Operating Temperature: -40°C; Max Operating Temperature: 85°C; Packaging: Tape and Reel; RoHS Compliant: Yes; ComponentLink1URL: http://www.ti.com/general/docs/suppproductinfo.tsp?distId=10&amp;gotoUrl=http%3A%2F%2Fwww.ti.com%2Flit%2Fgpn%2Flmx2572lp&src-supplier=Digi-Key; ComponentLink1Description: http://www.ti.com/general/docs/suppproductinfo.tsp?distId=10&amp;gotoUrl=http%3A%2F%2Fwww.ti.com%2Flit%2Fgpn%2Flmx2572lp&src-supplier=Digi-Key; ComponentLink2URL: http://www.ti.com/lit/ds/symlink/lmx2572lp.pdf?src-supplier=Digi-Key; ComponentLink2Description: http://www.ti.com/lit/ds/symlink/lmx2572lp.pdf?src-supplier=Digi-Key; Supplier 2: Arrow Electronics; Supplier Part Number 2: LMX2572LPRHAT; Supplier 3: Digi-Key; Supplier Part Number 3: 296-51375-1-ND
XO1 = SG-8018CG 25.0000M-TJHPA3: Oscillator XO 25MHz ±50ppm 15pF CMOS 55% 1.8V/2.5V/3.3V 4-Pin SMD T/R; Manufacturer: Epson; Supplier 1: Mouser; Supplier Part Number 1: 732-CG25M-TJHPA3; Manufacturer Part Number: SG-8018CG 25.0000M-TJHPA3; Stock 1: 221; Pricing 1: 1=1,11000, 10=1,03000, 100=0,88700, 250=0,88700, 500=0,78900, 1000=0,72700 (USD); ComponentLink1URL: http://datasheet.octopart.com/SG-8018CG-25.0000M-TJHPA3-Epson-datasheet-137868109.pdf?src-supplier=Future+Electronics; ComponentLink1Description: http://datasheet.octopart.com/SG-8018CG-25.0000M-TJHPA3-Epson-datasheet-137868109.pdf?src-supplier=Future+Electronics; Supplier 2: Arrow; Supplier Part Number 2: SG-8018CG 25.0000M-TJHPA3; Supplier 3: Future Electronics; Supplier Part Number 3: SG-8018CG 25.0000M-TJHPA3-REEL; Freq: 25MHz

## Sheet Filter and output.SchDoc
size A4; DocumentNumber: 2; SheetNumber: 2; SheetTotal: 4
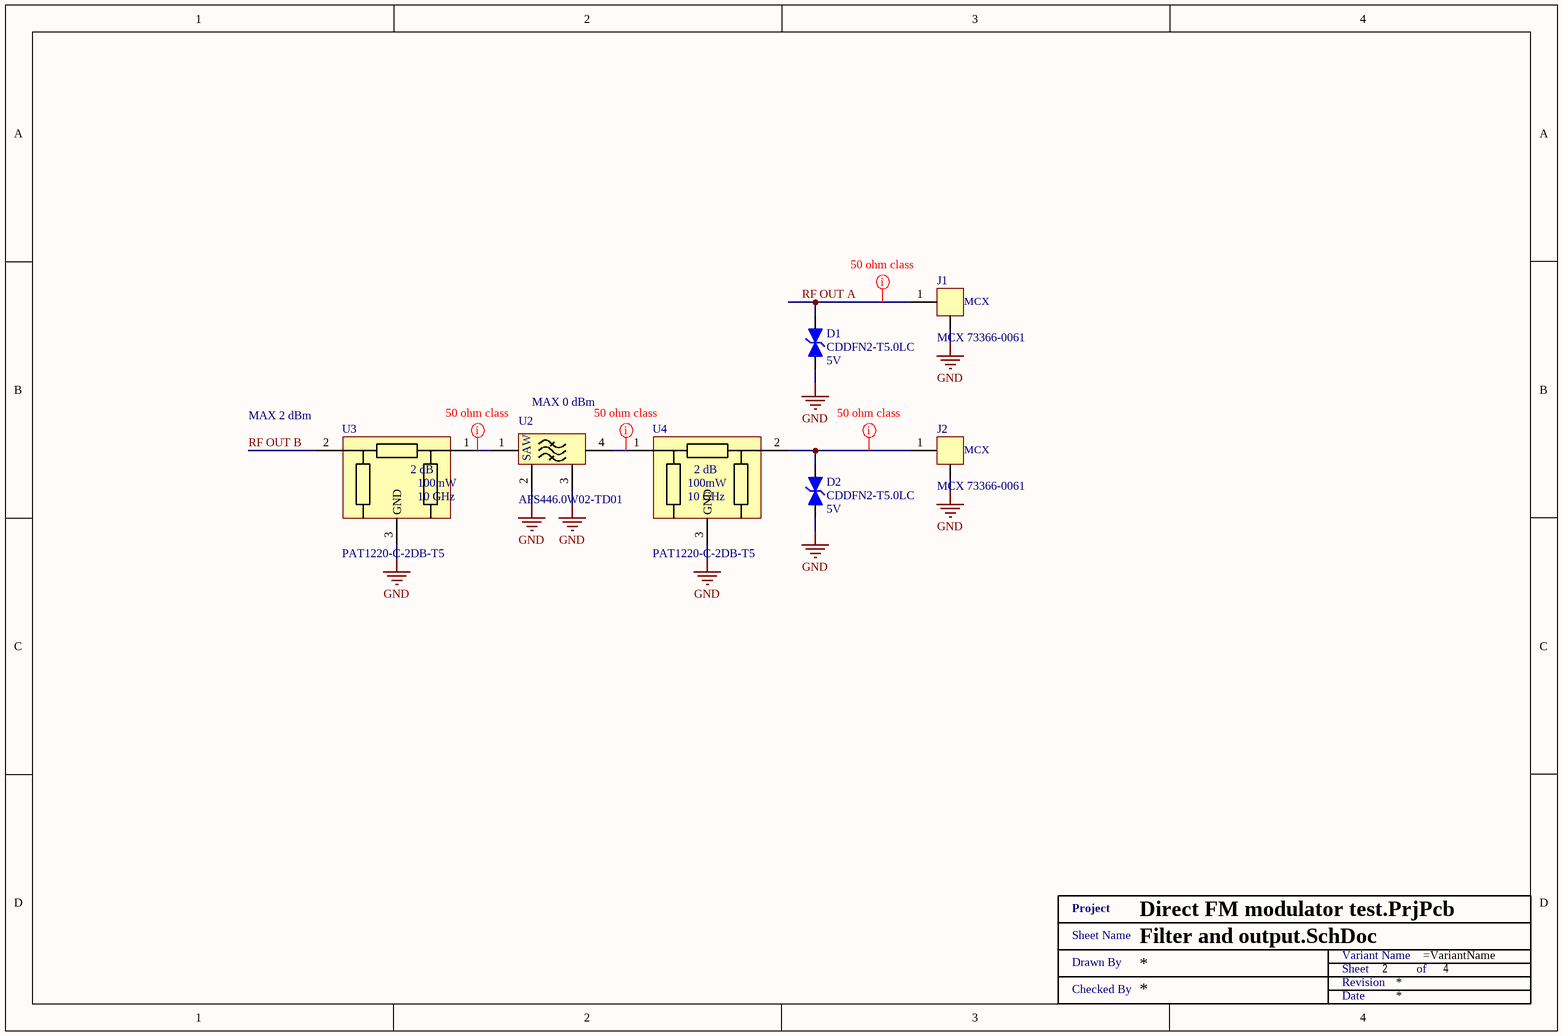
[diagram p1: Filter and output.SchDoc]

### Parts
(Parts that share a designator on the sheet are numbered #1, #2 ... from top to bottom, then left to right.)
D1  CDDFN2-T5.0LC  Operating Supply Voltage: 5V  [CDDFN2-T5.0LC]
D2  CDDFN2-T5.0LC  Operating Supply Voltage: 5V  [CDDFN2-T5.0LC]
J1  MCX 73366-0061  [73366-0061]
J2  MCX 73366-0061  [73366-0061]
U2  AFS446.0W02-TD01  [AFS446.0W02-TD01]
U3  PAT1220-C-2DB-T5  [PAT1220]
U4  PAT1220-C-2DB-T5  [PAT1220]
XX?#2  Title 1  (value not drawn)  (graphical)

### Nets
GND: D1.2 D2.2 J1.2(GND) J2.2(GND) U2.2(GND) U2.3(GND) U3.3(GND) U4.3(GND)
RF OUT A: D1.1 J1.1(INPUT)
RF OUT B: U3.2
NetD2_1: D2.1 J2.1(INPUT) U4.2
NetU2_1: U2.1(IN) U3.1
NetU2_4: U2.4(OUT) U4.1

### Layout directives
net class 50 ohm: NetD2_1, NetU2_1, NetU2_4, RF OUT A

### Notes on the sheet
- (near U3) MAX 2 dBm
- (near U2) MAX 0 dBm
- (in symbol AFS446.0W02-TD01) SAW
- (in symbol PAT1220-C-2DB-T5) 2 dB; 10 GHz
- (in symbol Title 1) Project; Sheet Name; Variant Name; Drawn By; Sheet; of; Revision; Checked By; Date

### Library data of the parts
D1 D2 = CDDFN2-T5.0LC: TVS DIODE 5VWM 25VC DFN2; Manufacturer: Bourns; Direction: Bidirectional; Max Surge Current: 5A; Breakdown Voltage: 7V; Clamping Voltage: 15V; Number of Channels: 1; Power Line Protection: No; Leakage Current: 1uA; Diode Type: ZENER; Capacitance: 12pF; Element Configuration: Single; Supplier 1: Mouser; Supplier Part Number 1: 652-CDDFN2-T5.0LC; Manufacturer Part Number: CDDFN2-T5.0LC; RoHS: Yes; Category: TVS Diodes; Stock 1: 37803; Pricing 1: 1=0.43000, 10=0.34500, 50=0.34500, 100=0.24100, 1000=0.15700, 10000=0.14100 (USD); Mount: Surface Mount; Case/Package: DFN; Number of Pins: 2; Contact Plating: Gold; Min Operating Temperature: -40°C; Max Operating Temperature: 85°C; Packaging: Tape and Reel; Package Quantity: 1; Polarity: Bidirectional; Termination: SMD/SMT; Reverse Standoff Voltage: 5V; Number of Bidirectional Channels: 1; Min Breakdown Voltage: 7V; Working Voltage: 5V; Resistor Type: Zener; Series: -; Max Breakdown Voltage: 7V; Length: 1mm; Radiation Hardening: No; RoHS Compliant: Yes; REACH SVHC: No SVHC; ComponentLink1URL: https://datasheet.ciiva.com/6817/1758341-6817680.pdf?src-supplier=Newark; ComponentLink1Description: https://datasheet.ciiva.com/6817/1758341-6817680.pdf?src-supplier=Newark; ComponentLink2URL: https://datasheet.ciiva.com/11193/cddfn2-t5-0lc-11193904.pdf?src-supplier=Avnet; ComponentLink2Description: https://datasheet.ciiva.com/11193/cddfn2-t5-0lc-11193904.pdf?src-supplier=Avnet; ComponentLink3URL: https://datasheet.ciiva.com/4507/cddfn2-txxc-71882-4507683.pdf?src-supplier=Mouser; ComponentLink3Description: https://datasheet.ciiva.com/4507/cddfn2-txxc-71882-4507683.pdf?src-supplier=Mouser; ComponentLink4URL: https://datasheet.ciiva.com/335/cddfn2-t5-0lc-335432.pdf?src-supplier=Digi-Key; ComponentLink4Description: https://datasheet.ciiva.com/335/cddfn2-t5-0lc-335432.pdf?src-supplier=Digi-Key; ComponentLink5URL: https://datasheet.ciiva.com/335/cddfn2-t5-0lc-335433.pdf?src-supplier=Digi-Key; ComponentLink5Description: https://datasheet.ciiva.com/335/cddfn2-t5-0lc-335433.pdf?src-supplier=Digi-Key; ComponentLink6URL: https://datasheet.ciiva.com/335/cddfn2-t5-0lc-335434.pdf?src-supplier=Digi-Key; ComponentLink6Description: https://datasheet.ciiva.com/335/cddfn2-t5-0lc-335434.pdf?src-supplier=Digi-Key; Supplier 2: Farnell; Supplier Part Number 2: 1860785; Supplier 3: Digi-Key; Supplier Part Number 3: CDDFN2-T5.0LCCT-ND; Supplier 4: Arrow Electronics; Supplier Part Number 4: CDDFN2-T5.0LC
J1 J2 = 73366-0061: CONN MCX JACK STR 50 OHM PCB; Manufacturer: Molex, LLC; Manufacturer Part Number: 0733660061; Connector Type: Jack, Female Socket; Contact Termination: Solder; Impedance: 50 Ohm; Body Material: Brass; Body Finish: Gold; Dielectric Material: Polytetrafluoroethylene (PTFE); Center Contact Material: Beryllium Copper; Mating Cycles: 500; RoHS: RoHS Compliant; Category: Connectors, Interconnects; Stock 1: 39394; Pricing 1: 1=1.95, 10=1.765, 25=1.6572, 50=1.5854, 100=1.5133, 250=1.36916, 500=1.26106, 1000=1.0809, 2500=1.00884 (USD); Packaging: Tray; Part Status: Active; Connector Style: MCX; Shield Termination: Solder; Mounting Type: Through Hole; Mounting Feature: -; Cable Group: -; Fastening Type: Snap-On; Features: -; Housing Color: Gold; Ingress Protection: -; Includes: -; Center Contact Plating: Gold; Operating Temperature: -55°C ~ 155°C; Insertion Loss: -; ComponentLink1URL: https://www.molex.com/pdm_docs/sd/733660061_sd.pdf; ComponentLink1Description: https://www.molex.com/pdm_docs/sd/733660061_sd.pdf; Supplier 1: Mouser; Supplier Part Number 1: 538-73366-0061; Supplier 2: Digi-Key; Supplier Part Number 2: WM5541-ND; Supplier 3: Farnell; Supplier Part Number 3: 1909245
U2 = AFS446.0W02-TD01: Saw Filters 446MHz; Manufacturer: Abracon; Voltage Rating (DC): 10V; Impedance: 50R; Insertion Loss: 4.5dB; Supplier 1: Mouser; Supplier Part Number 1: 815-AFS446.0W2-TD1; Manufacturer Part Number: AFS446.0W02-TD01; RoHS: Yes; Category: EMI / RFI Components; Stock 1: 608; Pricing 1: 1=0.93000, 10=0.85800, 50=0.70100, 100=0.57200, 1000=0.48600, 10000=0.34600 (USD); Min Operating Temperature: -40°C; Max Operating Temperature: 80°C; Frequency: 446MHz; Termination: Radial; RoHS Compliant: Yes; ComponentLink1URL: https://datasheet.ciiva.com/4548/afs446-0w02-td01-43048-4548368.pdf?src-supplier=Mouser; ComponentLink1Description: https://datasheet.ciiva.com/4548/afs446-0w02-td01-43048-4548368.pdf?src-supplier=Mouser
U3 U4 = PAT1220-C-2DB-T5: Chip Attenuator 10GHz 2dB, 100mW; Manufacturer: Susumu; Impedance: 50R; Supplier 1: Mouser; Supplier Part Number 1: 754-PAT1220C-2DBT5; Manufacturer Part Number: PAT1220-C-2DB-T5; RoHS: Yes; Category: Uncategorized; Stock 1: 17229; Pricing 1: 1=0.35000, 10=0.30800, 25=0.27800, 100=0.24300, 250=0.21300, 500=0.18800, 1000=0.14800, 5000=0.12500, 10000=0.12000 (USD); Mount: Surface Mount; Case/Package: 0805; Number of Pins: 3; Case Code (Imperial): 0805; Case Code (Metric): 2012; Min Operating Temperature: -55°C; Max Operating Temperature: 125°C; Packaging: Tape and Reel; Package Quantity: 1; Max Power Dissipation: 100mW; Attenuation Value: 2dB; Frequency: 10GHz; Power Rating: 100mW; Lead Free: Lead Free; ComponentLink1URL: https://datasheet.ciiva.com/15101/getdatasheetpartid-497046-15101143.pdf?src-supplier=Verical; ComponentLink1Description: https://datasheet.ciiva.com/15101/getdatasheetpartid-497046-15101143.pdf?src-supplier=Verical; ComponentLink2URL: https://datasheet.ciiva.com/2788/products-38-2788379.pdf?src-supplier=Digi-Key; ComponentLink2Description: https://datasheet.ciiva.com/2788/products-38-2788379.pdf?src-supplier=Digi-Key; ComponentLink3URL: https://datasheet.ciiva.com/24156/products-38-24156863.pdf?src-supplier=Future+Electronics; ComponentLink3Description: https://datasheet.ciiva.com/24156/products-38-24156863.pdf?src-supplier=Future+Electronics; ComponentLink4URL: https://datasheet.ciiva.com/2788/products-38-2788377.pdf?src-supplier=Digi-Key; ComponentLink4Description: https://datasheet.ciiva.com/2788/products-38-2788377.pdf?src-supplier=Digi-Key; ComponentLink5URL: https://datasheet.ciiva.com/2788/products-38-2788378.pdf?src-supplier=Digi-Key; ComponentLink5Description: https://datasheet.ciiva.com/2788/products-38-2788378.pdf?src-supplier=Digi-Key

## Sheet Connectors.SchDoc
size A4; DocumentNumber: 3; SheetNumber: 3; SheetTotal: 4
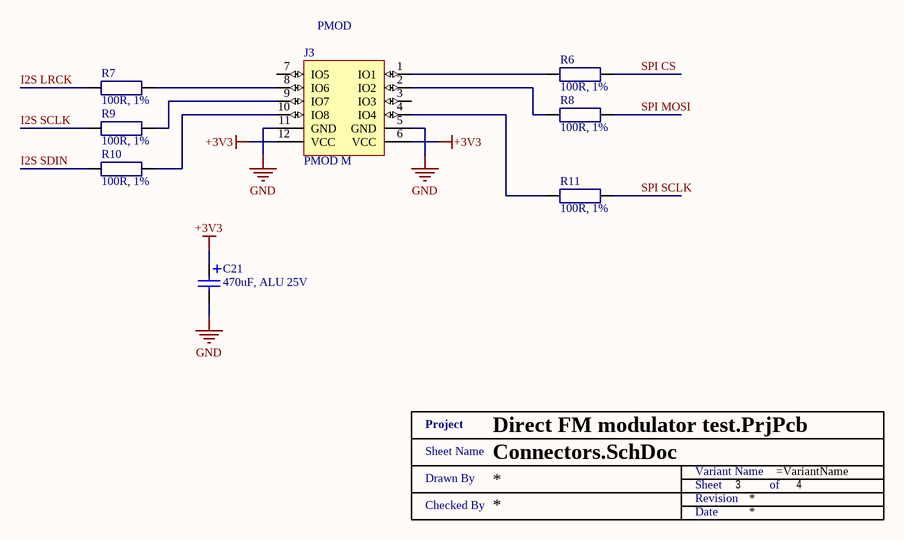
[diagram p2: Connectors.SchDoc]

### Parts
(Parts that share a designator on the sheet are numbered #1, #2 ... from top to bottom, then left to right.)
C21  470uF, ALU 25V  [WCAP-ATG8_8x11.5x3.5]
J3  PMOD M  [PMOD M]
R6  100R, 1%  [SMD0402 - R]
R7  100R, 1%  [SMD0402 - R]
R8  100R, 1%  [SMD0402 - R]
R9  100R, 1%  [SMD0402 - R]
R10  100R, 1%  [SMD0402 - R]
R11  100R, 1%  [SMD0402 - R]
XX?#3  Title 1  (value not drawn)  (graphical)

### Nets
+3V3: C21.1 J3.6(VCC) J3.12(VCC)
GND: C21.2 J3.5(GND) J3.11(GND)
I2S LRCK: R7.1
I2S SCLK: R9.1
I2S SDIN: R10.1
SPI CS: R6.2
SPI MOSI: R8.2
SPI SCLK: R11.2
NetJ3_1: J3.1(IO1) R6.1
NetJ3_2: J3.2(IO2) R8.1
NetJ3_4: J3.4(IO4) R11.1
NetJ3_8: J3.8(IO6) R7.2
NetJ3_9: J3.9(IO7) R9.2
NetJ3_10: J3.10(IO8) R10.2

Not connected (* = marked no-connect by the designer): J3 3(IO3) 7(IO5)

### Notes on the sheet
- (near J3) PMOD
- (in symbol Title 1) Project; Sheet Name; Variant Name; Drawn By; Sheet; of; Revision; Checked By; Date

### Library data of the parts
C21 = 860010474013: WURTH ELEKTRONIK - 860010474013 - CAP, ALU ELEC, 470UF, 25V, RADIAL; Capacitance: 470u; Product Range: WCAP-ATG8 Series; Capacitance Tolerance: ± 20%; Capacitor Terminals: Radial Leaded; Lifetime @ Temperature: 2000 hours @ 85; SVHC: No SVHC (07-Jul-2017); Supplier 1: Farnell; Supplier Part Number 1: 2465681; Manufacturer: WURTH ELEKTRONIK; Manufacturer Part Number: 860010474013; RoHS: YES; Stock 1: 134; Pricing 1: 1=0.313, 3=0.282, 5=0.257, 10=0.232, 20=0.23, 50=0.189, 250=0.18 (GBP); Voltage Rating: 25V; Diameter: 8; Lead Spacing: 3.5; Height: 11.5; Operating Temperature Min: -40; Operating Temperature Max: 85; ESR: -; Automotive Qualification Standard: -; RoHS Phthalates Compliant: Yes; MSL: MSL 1 - Unlimited; Packaging: Each<!--FANDB--><div class="features-and-benefits-container"><div class="features-and-benefits-desc-container"><span class="features-and-benefits-container-desc">Electrolytic Capacitor, 470 µF, 25 V, WCAP-ATG8 Series, ± 20%, Radial Leaded, 8 mm</span></div></div>; ComponentLink1URL: http://www.farnell.com/datasheets/1879524.pdf; ComponentLink1Description: http://www.farnell.com/datasheets/1879524.pdf; Supplier 2: Digi-Key; Supplier Part Number 2: 732-8636-1-ND; Supplier 3: Mouser; Supplier Part Number 3: 710-860010474013
J3 = PMOD M: WR-PHD 2.54 mm THT Angled Dual Pin Header, 12 pins; Manufacturer: Wurth Electronics; Manufacturer Part Number: 61301221021; Number of Positions: 12; Gender: Male; Connector Type: Male Pin; Pitch: 0.1inch; Supplier 1: Mouser; Supplier Part Number 1: 710-61301221021; RoHS: Yes; Category: Connectors; Pricing 1: 1=0.94000, 10=0.79300, 50=0.55100, 100=0.50100, 1000=0.45500, 10000=0.45500 (USD); Mount: Through Hole; Contact Plating: Gold; Contact Material: Copper; Color: Black; Number of Rows: 2; Packaging: Bulk; Termination: Solder; Number of Contacts: 12; Row Spacing: 0.1inch; Contact Mating Length: 0.236inch; REACH SVHC: Unknown; RoHS Compliant: Yes; ComponentLink1URL: https://katalog.we-online.de/em/datasheet/6130xx21021.pdf?src-supplier=Digi-Key; ComponentLink1Description: https://katalog.we-online.de/em/datasheet/6130xx21021.pdf?src-supplier=Digi-Key; ComponentLink2URL: http://www.farnell.com/cad/1737270.pdf?src-supplier=Element14; ComponentLink2Description: http://www.farnell.com/cad/1737270.pdf?src-supplier=Element14; Supplier 2: Farnell; Supplier Part Number 2: 2356197; Supplier 3: Digi-Key; Supplier Part Number 3: 732-5354-ND; Supplier 4: RSComponents; Supplier Part Number 4: 8281711
R6-R11 = RC0402FR-07100RL: as R2 on sheet PLL; Supplier 1: Farnell; Supplier Part Number 1: 9239111; Manufacturer: YAGEO; Manufacturer Part Number: RC0402FR-07100RL; RoHS: YES; Stock 1: 260492; Pricing 1: 10=0.385, 100=0.38, 500=0.285, 2500=0.144, 5000=0.121 (EUR); Resistor Element Material: Thick Film; Resistance Tolerance: ± 1%; Automotive Qualification Standard: -; MSL: MSL 1 - Unlimited; Operating Temperature Max: 155; Operating Temperature Min: -55; ComponentLink1URL: http://www.farnell.com/datasheets/2167052.pdf; ComponentLink1Description: http://www.farnell.com/datasheets/2167052.pdf; Supplier 2: Mouser; Supplier Part Number 2: 603-RC0402FR-07100RL

## Sheet Poznamky.SchDoc
size A2; DocumentNumber: 4; SheetNumber: 4; SheetTotal: 4
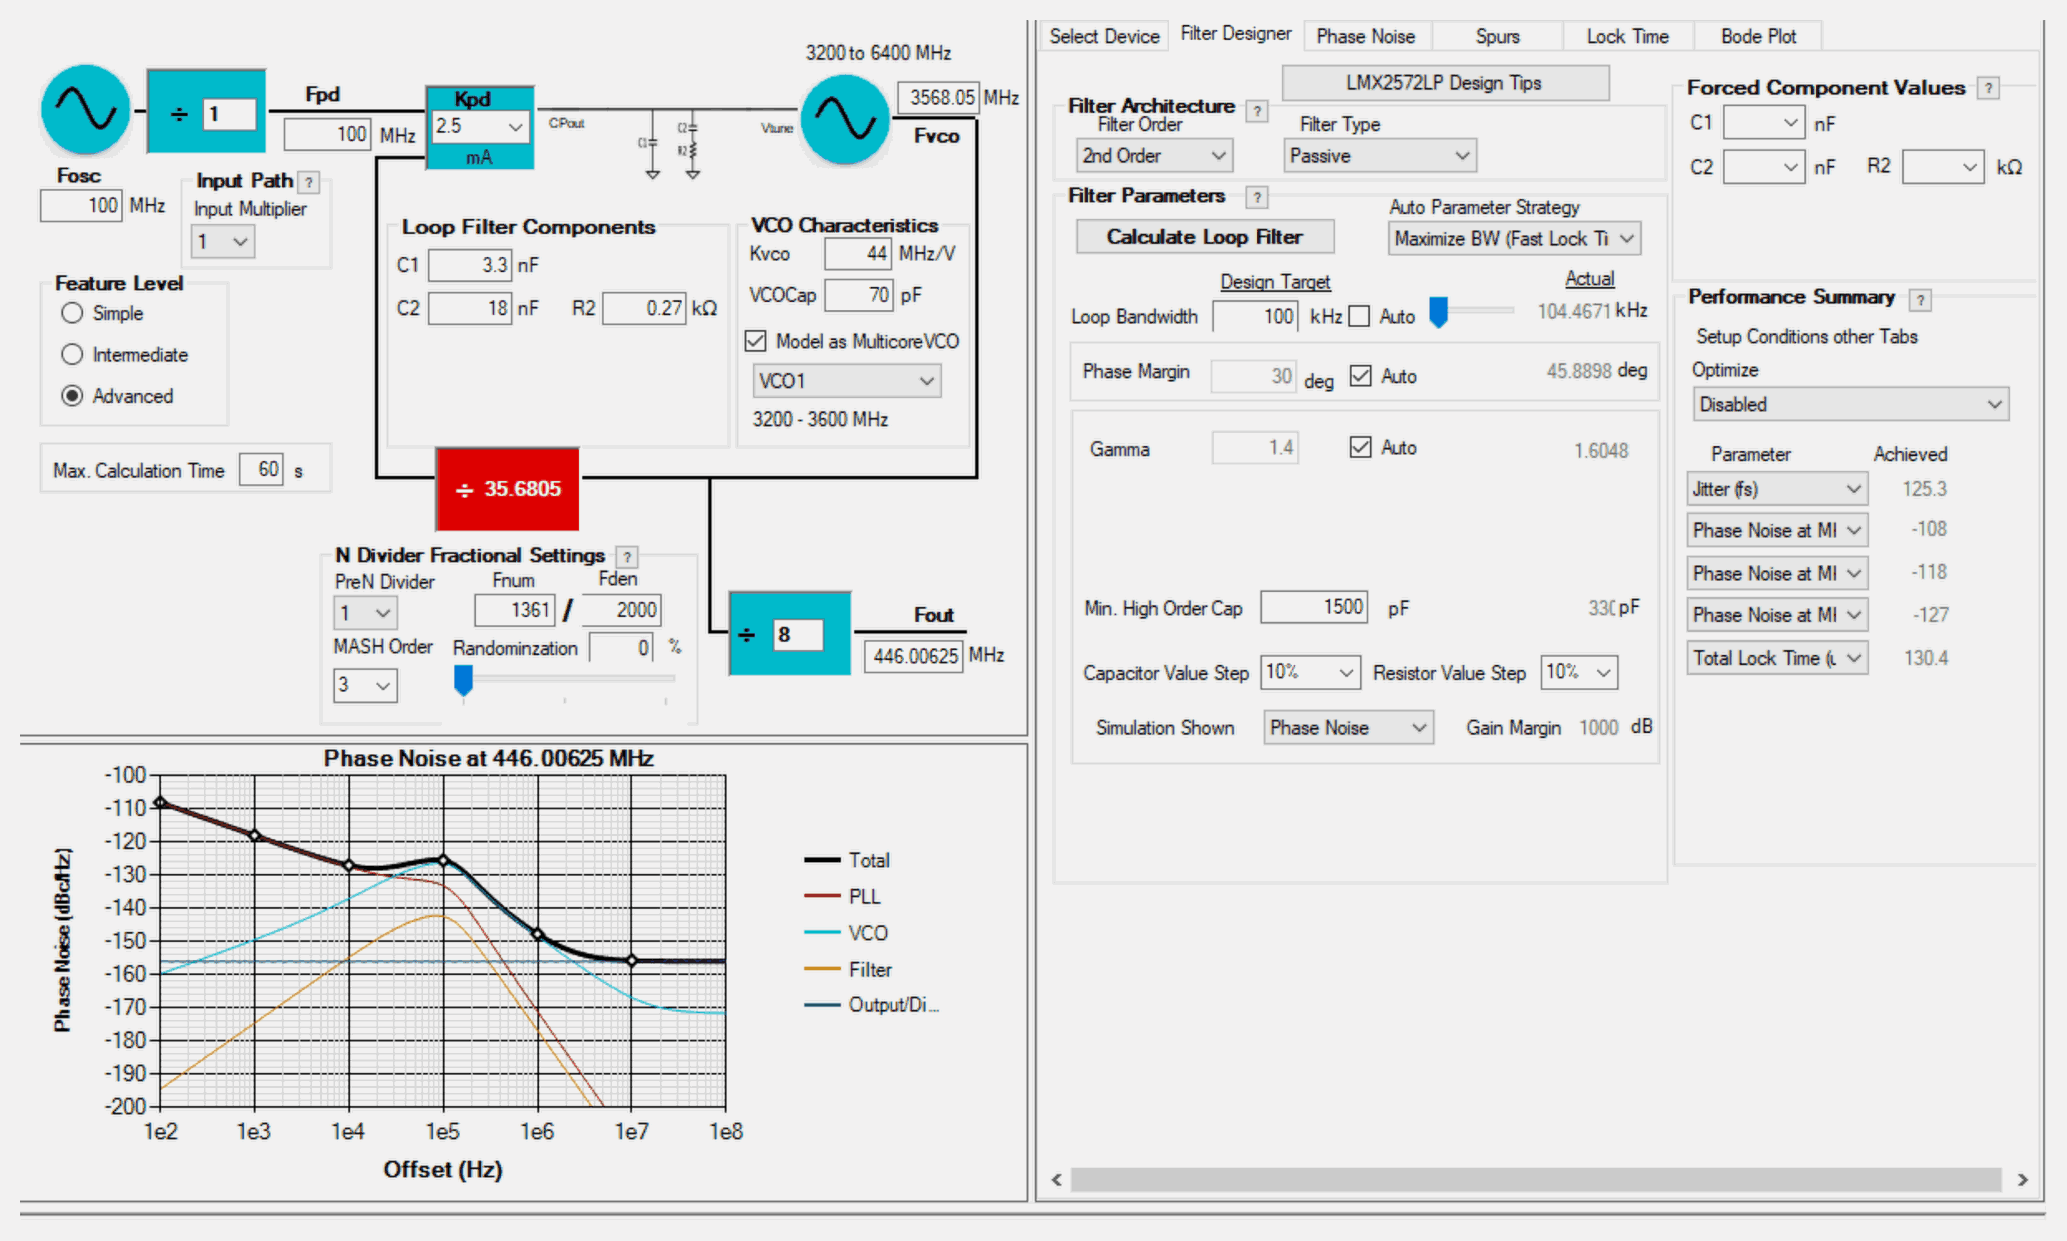
[diagram p3: Poznamky.SchDoc]

## Nets that join several sheets
+3V3: PLL (13 pins), Connectors (C21.1 J3.6 J3.12)
GND: PLL (32 pins), Filter and output (8 pins), Connectors (C21.2 J3.5 J3.11)
I2S LRCK: PLL (U1.28), Connectors (R7.1)
I2S SCLK: PLL (U1.30), Connectors (R9.1)
I2S SDIN: PLL (U1.32), Connectors (R10.1)
RF OUT A: PLL (C1.2), Filter and output (D1.1 J1.1)
RF OUT B: PLL (C3.2), Filter and output (U3.2)
SPI CS: PLL (U1.24), Connectors (R6.2)
SPI MOSI: PLL (U1.17), Connectors (R8.2)
SPI SCLK: PLL (U1.16), Connectors (R11.2)